# EAGLE design EnsembleEight (EAGLE 7.6.0)
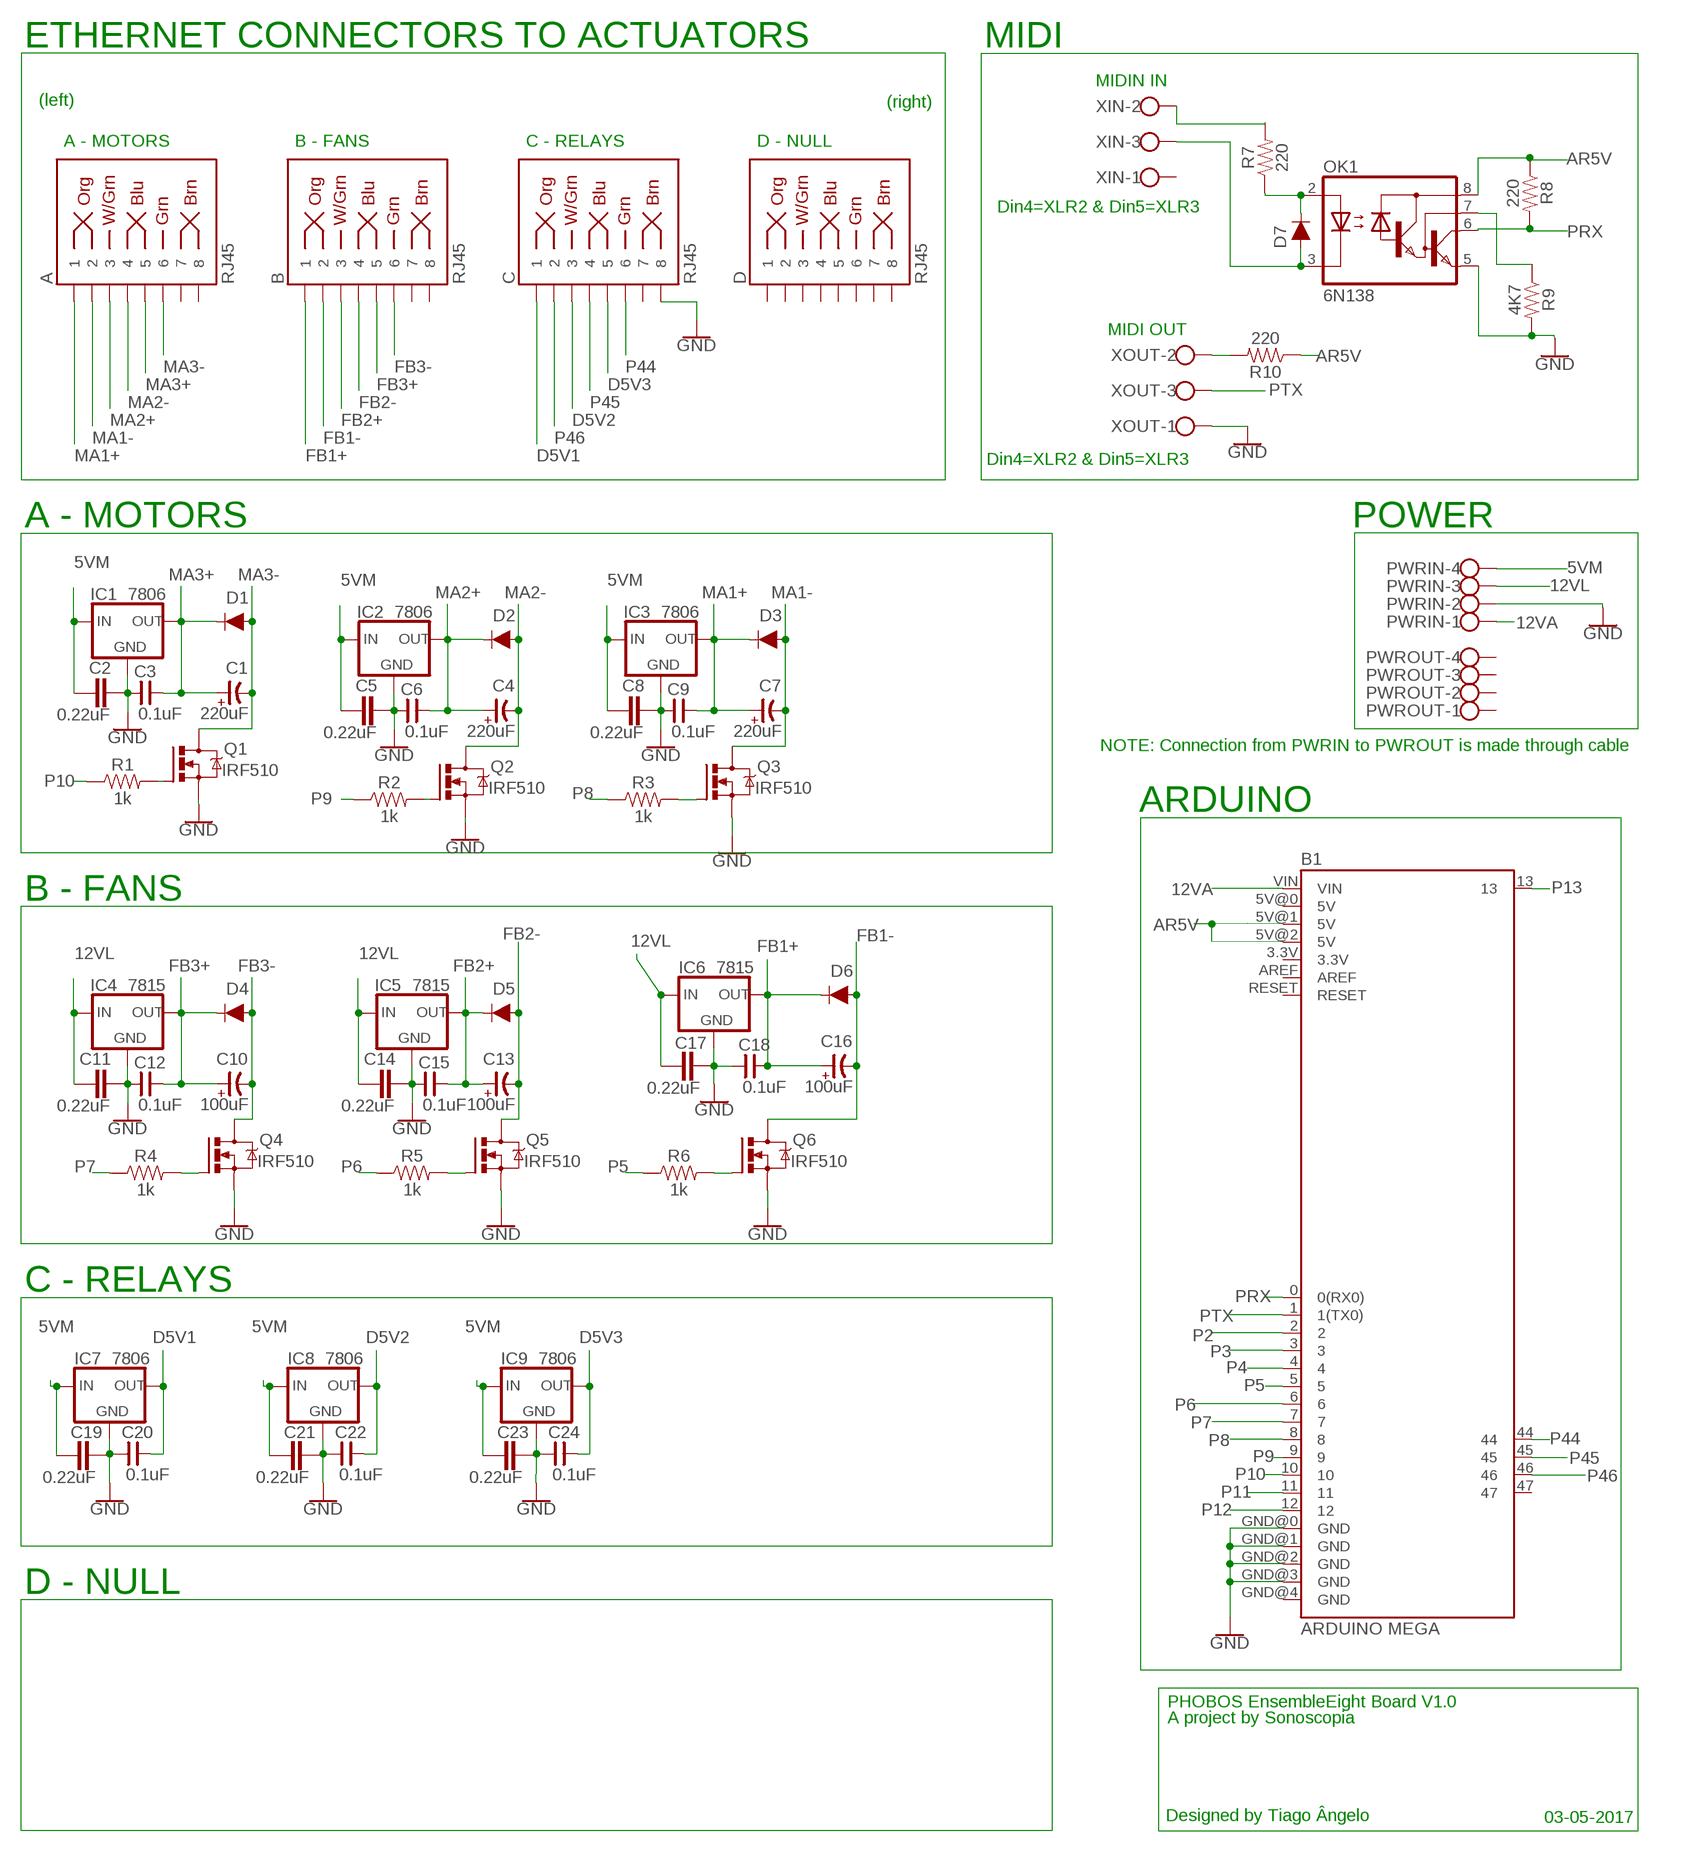
[diagram p0: schematic, sheet 1]

## Parts
A  RJ45  RJ45-8  [RJ45-8]
B  RJ45  RJ45-8  [RJ45-8]
B1  ARDUINO MEGA  ARDUINO_MEGA_R3FULL  [ARDUINO_MEGA]
C  RJ45  RJ45-8  [RJ45-8]
C1  220uF  CP-E-035X080  [E-035X080]
C2  0.22uF  C5/3  [C5B3]
C3  0.1uF  CNP-C025-050X025  [C025-050X025]
C4  220uF  CP-E-035X080  [E-035X080]
C5  0.22uF  C5/3  [C5B3]
C6  0.1uF  CNP-C025-050X025  [C025-050X025]
C7  220uF  CP-E-035X080  [E-035X080]
C8  0.22uF  C5/3  [C5B3]
C9  0.1uF  CNP-C025-050X025  [C025-050X025]
C10  100uF  CAP-MASTER_CP-E-020X050  [CAP-MASTER_E-020X050]
C11  0.22uF  C5/3  [C5B3]
C12  0.1uF  CNP-C025-050X025  [C025-050X025]
C13  100uF  CAP-MASTER_CP-E-020X050  [CAP-MASTER_E-020X050]
C14  0.22uF  C5/3  [C5B3]
C15  0.1uF  CNP-C025-050X025  [C025-050X025]
C16  100uF  CAP-MASTER_CP-E-020X050  [CAP-MASTER_E-020X050]
C17  0.22uF  C5/3  [C5B3]
C18  0.1uF  CNP-C025-050X025  [C025-050X025]
C19  0.22uF  C5/3  [C5B3]
C20  0.1uF  CNP-C025-050X025  [C025-050X025]
C21  0.22uF  C5/3  [C5B3]
C22  0.1uF  CNP-C025-050X025  [C025-050X025]
C23  0.22uF  C5/3  [C5B3]
C24  0.1uF  CNP-C025-050X025  [C025-050X025]
D  RJ45  RJ45-8  [RJ45-8]
D1  1A/50V/1.1V  DIODE-KIT2  [DIODE-1N4001-KIT]
D2  1A/50V/1.1V  DIODE-KIT2  [DIODE-1N4001-KIT]
D3  1A/50V/1.1V  DIODE-KIT2  [DIODE-1N4001-KIT]
D4  1A/50V/1.1V  DIODE-KIT2  [DIODE-1N4001-KIT]
D5  1A/50V/1.1V  DIODE-KIT2  [DIODE-1N4001-KIT]
D6  1A/50V/1.1V  DIODE-KIT2  [DIODE-1N4001-KIT]
D7  200mA/100V/1V  DIODE-1N4148  [DIODE-1N4148]
IC1  7806  78XXS  [78XXS]
IC2  7806  78XXS  [78XXS]
IC3  7806  78XXS  [78XXS]
IC4  7815  78XXS  [78XXS]
IC5  7815  78XXS  [78XXS]
IC6  7815  78XXS  [78XXS]
IC7  7806  78XXS  [78XXS]
IC8  7806  78XXS  [78XXS]
IC9  7806  78XXS  [78XXS]
OK1  6N138  [DIL08]
PWRIN  W237-4  [W237-4]
PWROUT  W237-4  [W237-4]
Q1  IRF510  IRF520  [TO220BV]
Q2  IRF510  IRF520  [TO220BV]
Q3  IRF510  IRF520  [TO220BV]
Q4  IRF510  IRF520  [TO220BV]
Q5  IRF510  IRF520  [TO220BV]
Q6  IRF510  IRF520  [TO220BV]
R1  1k  1KOHM-VERT-1/4W-1%  [AXIAL-0.1]
R2  1k  1KOHM-VERT-1/4W-1%  [AXIAL-0.1]
R3  1k  1KOHM-VERT-1/4W-1%  [AXIAL-0.1]
R4  1k  1KOHM-VERT-1/4W-1%  [AXIAL-0.1]
R5  1k  1KOHM-VERT-1/4W-1%  [AXIAL-0.1]
R6  1k  1KOHM-VERT-1/4W-1%  [AXIAL-0.1]
R7  220  1KOHM-HORIZ-1/4W-5%  [AXIAL-0.3]
R8  220  1KOHM-HORIZ-1/4W-5%  [AXIAL-0.3]
R9  4K7  1KOHM-HORIZ-1/4W-5%  [AXIAL-0.3]
R10  220  1KOHM-HORIZ-1/4W-5%  [AXIAL-0.3]
XIN  W237-103  [W237-103]
XOUT  W237-103  [W237-103]

## Nets
5VM [5VM]: C2.1 C5.1 C8.1 C19.1 C21.1 C23.1 IC1.IN IC2.IN IC3.IN IC7.IN IC8.IN IC9.IN PWRIN.4
12VA [12VA]: B1.VIN PWRIN.1
12VL [12VL]: C11.1 C14.1 C17.1 IC4.IN IC5.IN IC6.IN PWRIN.3
AR5V: B1.5V@1(5V) B1.5V@2(5V) OK1.8(VCC) R8.P$1 R10.P$1
D5V1: C20.2 C.1 IC7.OUT
D5V2: C22.2 C.3 IC8.OUT
D5V3: C24.2 C.5 IC9.OUT
FB1+: B.1 C16.+ C18.2 D6.C IC6.OUT
FB1-: B.2 C16.- D6.A Q6.D
FB2+: B.3 C13.+ C15.2 D5.C IC5.OUT
FB2-: B.4 C13.- D5.A Q5.D
FB3+: B.5 C10.+ C12.2 D4.C IC4.OUT
FB3-: B.6 C10.- D4.A Q4.D
GND [GND]: B1.GND@0(GND) B1.GND@1(GND) B1.GND@2(GND) B1.GND@3(GND) C2.2 C3.1 C5.2 C6.1 C8.2 C9.1 C11.2 C12.1 C14.2 C15.1 C17.2 C18.1 C19.2 C20.1 C21.2 C22.1 C23.2 C24.1 C.8 IC1.GND IC2.GND IC3.GND IC4.GND IC5.GND IC6.GND IC7.GND IC8.GND IC9.GND OK1.5(GND) PWRIN.2 Q1.S Q2.S Q3.S Q4.S Q5.S Q6.S R9.P$2 XOUT.1
MA1+: A.1 C7.+ C9.2 D3.C IC3.OUT
MA1-: A.2 C7.- D3.A Q3.D
MA2+: A.3 C4.+ C6.2 D2.C IC2.OUT
MA2-: A.4 C4.- D2.A Q2.D
MA3+: A.5 C1.+ C3.2 D1.C IC1.OUT
MA3-: A.6 C1.- D1.A Q1.D
N$1: Q1.G R1.P$2
N$2: R10.P$2 XOUT.2
N$4: Q3.G R3.P$2
N$5: Q4.G R4.P$2
N$9: Q5.G R5.P$2
N$14: Q6.G R6.P$2
N$20: Q2.G R2.P$2
N$25: D7.A OK1.3(C) XIN.3
N$26: D7.C OK1.2(A) R7.P$1
N$27: R7.P$2 XIN.2
N$29: OK1.7(VB) R9.P$1
P2: B1.2
P3: B1.3
P4: B1.4
P5: B1.5 R6.P$1
P6: B1.6 R5.P$1
P7: B1.7 R4.P$1
P8: B1.8 R3.P$1
P9: B1.9 R2.P$1
P10: B1.10 R1.P$1
P11: B1.11
P12: B1.12
P13: B1.13
P44: B1.44 C.6
P45: B1.45 C.4
P46: B1.46 C.2
PRX: B1.0(0(RX0)) OK1.6(VO) R8.P$2
PTX: B1.1(1(TX0)) XOUT.3
Unconnected: A.7 A.8 B1.3.3V B1.5V@0(5V) B1.47 B1.AREF B1.GND@4(GND) B1.RESET B.7 B.8 C.7 D.1 D.2 D.3 D.4 D.5 D.6 D.7 D.8 PWROUT.1 PWROUT.2 PWROUT.3 PWROUT.4 XIN.1

## Notes on the sheet
- ETHERNET CONNECTORS TO ACTUATORS | MIDI
- MIDIN IN
- (left) | (right)
- A - MOTORS | B - FANS | C - RELAYS | D - NULL
- Din4=XLR2 & Din5=XLR3
- MIDI OUT
- Din4=XLR2 & Din5=XLR3
- A - MOTORS | POWER
- NOTE: Connection from PWRIN to PWROUT is made through cable
- ARDUINO
- B - FANS
- C - RELAYS
- D - NULL
- PHOBOS EnsembleEight Board V1.0
- A project by Sonoscopia
- Designed by Tiago Ângelo | 03-05-2017

## Library data of the parts
A B C D = SparkFun-Connectors:RJ45-8: RJ45 Jack - 8 pin Simple RJ45, 8-pin connection. Commonly used for Cat5, Cat5e, and Cat6 Ethernet cables. Here is the connector we sell at SparkFun: RJ45 8-Pin Connector <https://www.sparkfun.com/products/643> (PRT-00643) Datasheet <https://cdn.sparkfun.com/datasheets/Prototyping/04908.pdf> It is used on this SparkFun product: SparkFun RJ45 Breakout <https://www.sparkfun.com/products/716> (BOB-00716) Note, you may also be interested in the "MAGJACK" version of this. It is basically a RJ45 connector, but also has some status LEDs built into the connector housing. You can check that out in this library at the device named "MAGJACK.dev" and see these products online: RJ45 Ethernet MagJack-Compatible <https://www.sparkfun.com/products/8534> (PRT-08534) SparkFun RJ45 MagJack Breakout <https://www.sparkfun.com/products/13021> (BOB-13021); PROD_ID: CONN-08506; SF_ID: PRT-00643
B1 = PHOBOS-Boards:ARDUINO_MEGA_R3: Arduino Mega R3 ATmega2560 R3 compatible footprint. SparkFun Products: Arduino Mega 2560 R3 <https://www.sparkfun.com/products/11061>
C1 C4 C7 = cap-master:CP-: POLARIZED CAP
C2 C5 C8 C11 C14 C17 C19 C21 C23 = capacitor-wima:C: CAPACITOR naming: grid - package width
C3 C6 C9 C12 C15 C18 C20 C22 C24 = cap-master:CNP-: NON-POLARIZED CAP
C10 C13 C16 = PHOBOS-lbr:CAP-MASTER_CP-: POLARIZED CAP
D1-D6 = SparkFun-DiscreteSemi:DIODE: Diode These are standard reverse protection diodes and small signal diodes. SparkFun Products: SparkFun SparkPunk Sound Kit <https://www.sparkfun.com/products/11177> SparkFun ESP8266 Thing <https://www.sparkfun.com/products/13231>; PROD_ID: DIO-09176
D7 = SparkFun-DiscreteSemi:DIODE: Diode These are standard reverse protection diodes and small signal diodes. SparkFun Products: SparkFun SparkPunk Sound Kit <https://www.sparkfun.com/products/11177> SparkFun ESP8266 Thing <https://www.sparkfun.com/products/13231>; PROD_ID: DIO-08378
IC1-IC9 = v-reg:78XXS: VOLTAGE REGULATOR
OK1 = optocoupler:6N138: MOTOROLA OPTO COUPLER; MF: VISHAY/TELEFUNKEN; MPN: 6N138; OC_FARNELL: 9860150; OC_NEWARK: 35K5294
PWRIN PWROUT = con-wago-500:W237-4: WAGO SCREW CLAMP; OC_FARNELL: unknown; OC_NEWARK: unknown
Q1-Q6 = transistor-power:IRF520: HEXFET Power MOSFET
R1-R6 = SparkFun-Resistors:1KOHM: 1kΩ resistor A resistor is a passive two-terminal electrical component that implements electrical resistance as a circuit element. Resistors act to reduce current flow, and, at the same time, act to lower voltage levels within circuits. - Wikipedia; PROD_ID: RES-12182
R7-R10 = SparkFun-Resistors:1KOHM: 1kΩ resistor A resistor is a passive two-terminal electrical component that implements electrical resistance as a circuit element. Resistors act to reduce current flow, and, at the same time, act to lower voltage levels within circuits. - Wikipedia; PROD_ID: RES-08380; VALUE: 1k
XIN XOUT = con-wago-500:W237-103: WAGO SCREW CLAMP; MPN: 237-103; OC_FARNELL: unknown; OC_NEWARK: 18M7116

## Net classes
0 default: width 0.508 mm, drill 0.508 mm, clearance 0.406 mm
1 GND: width 1.016 mm, drill 0.508 mm, clearance 0.508 mm
2 5VM: width 1.016 mm, drill 0.508 mm, clearance 0.508 mm
3 12VL: width 0.61 mm, drill 0.508 mm, clearance 0.508 mm
4 12VA: width 0.508 mm, drill 0.508 mm, clearance 0.508 mm
5 AR5V: width 0.406 mm, drill 0.508 mm, clearance 0.508 mm
6 PTX: width 0.406 mm, drill 0.508 mm, clearance 0.508 mm
7 PRX: width 0.406 mm, drill 0.508 mm, clearance 0.508 mm

## Board
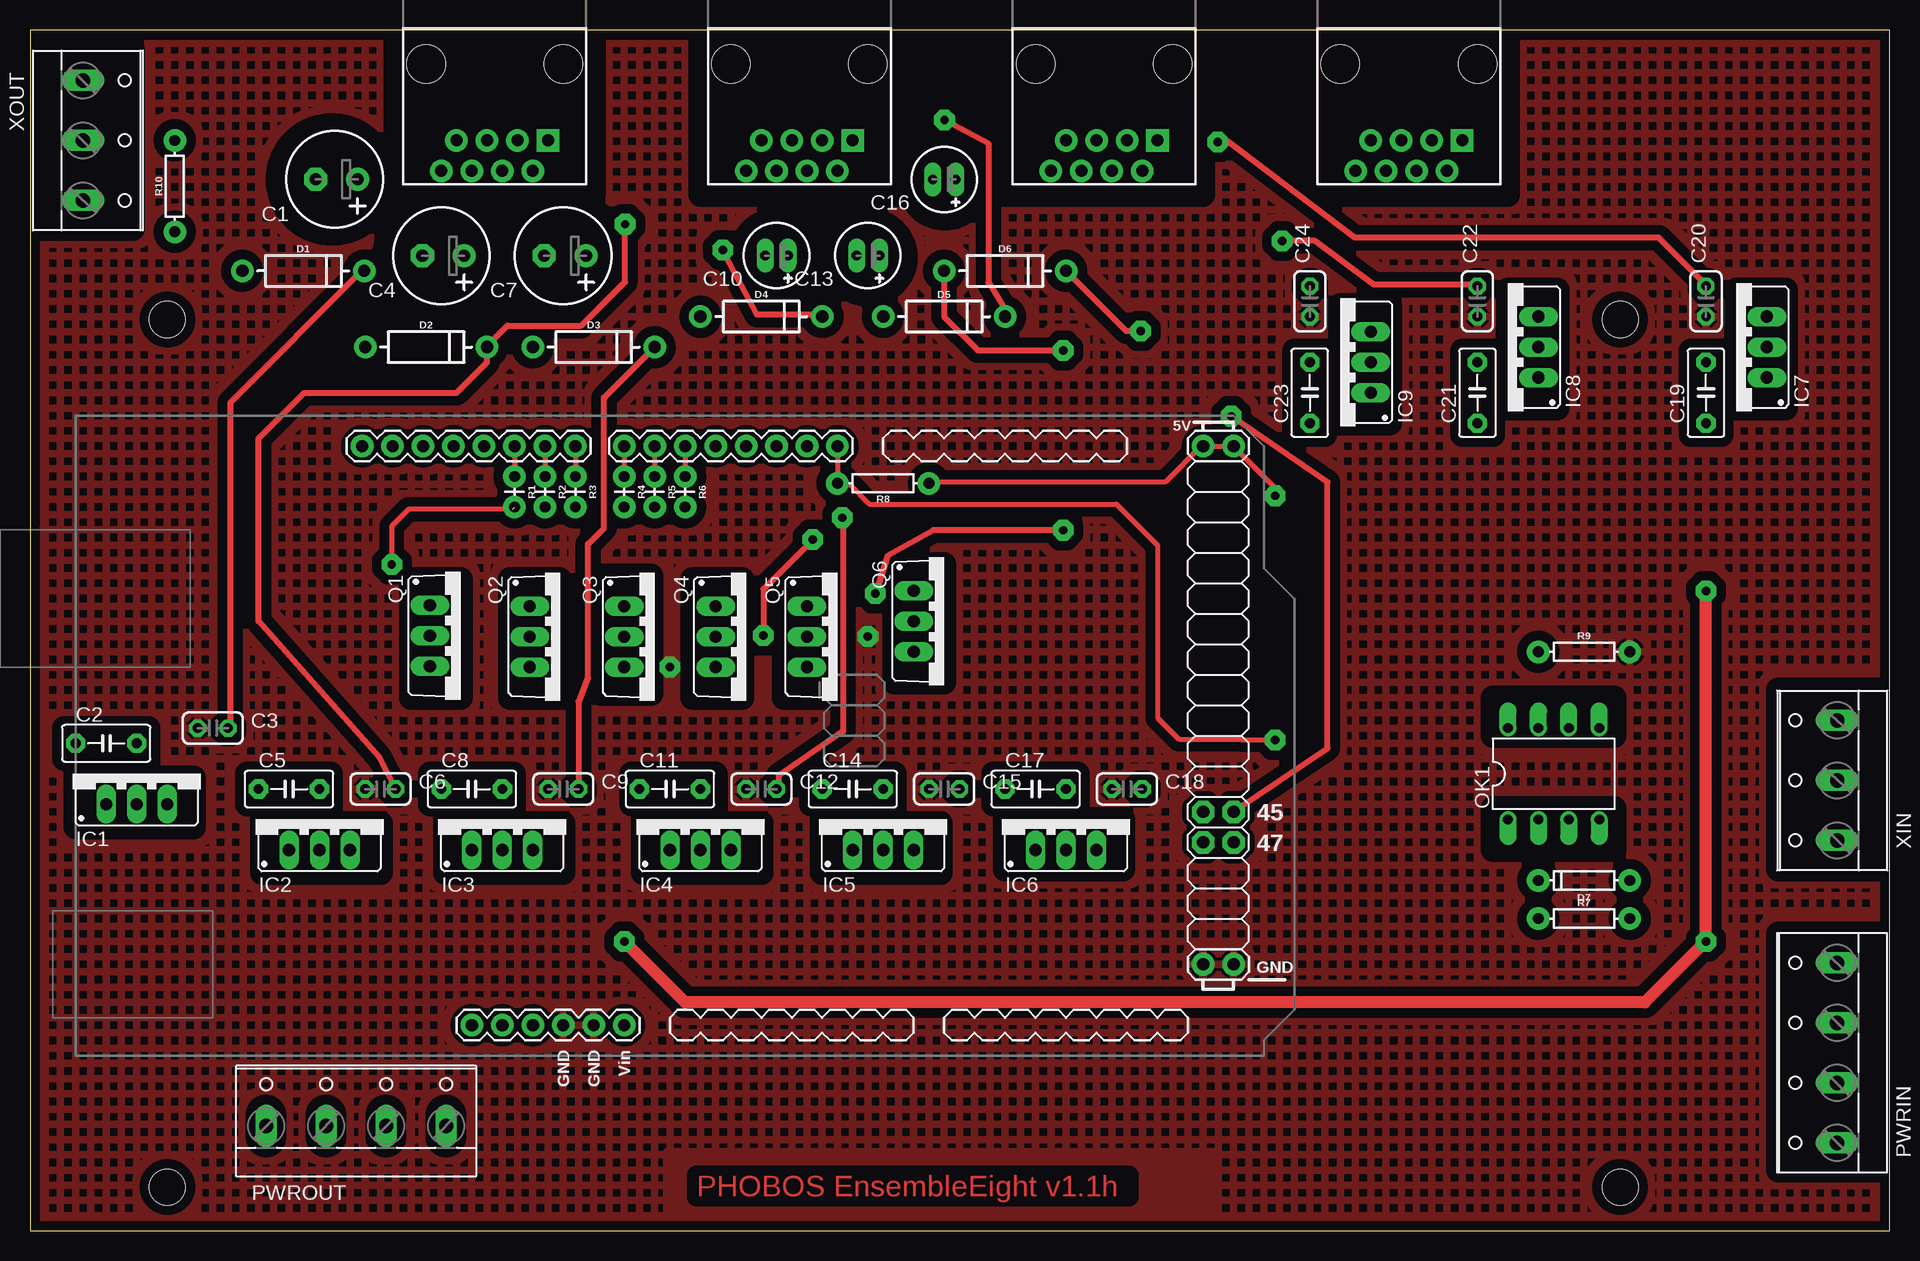
[diagram p1: board, top side]
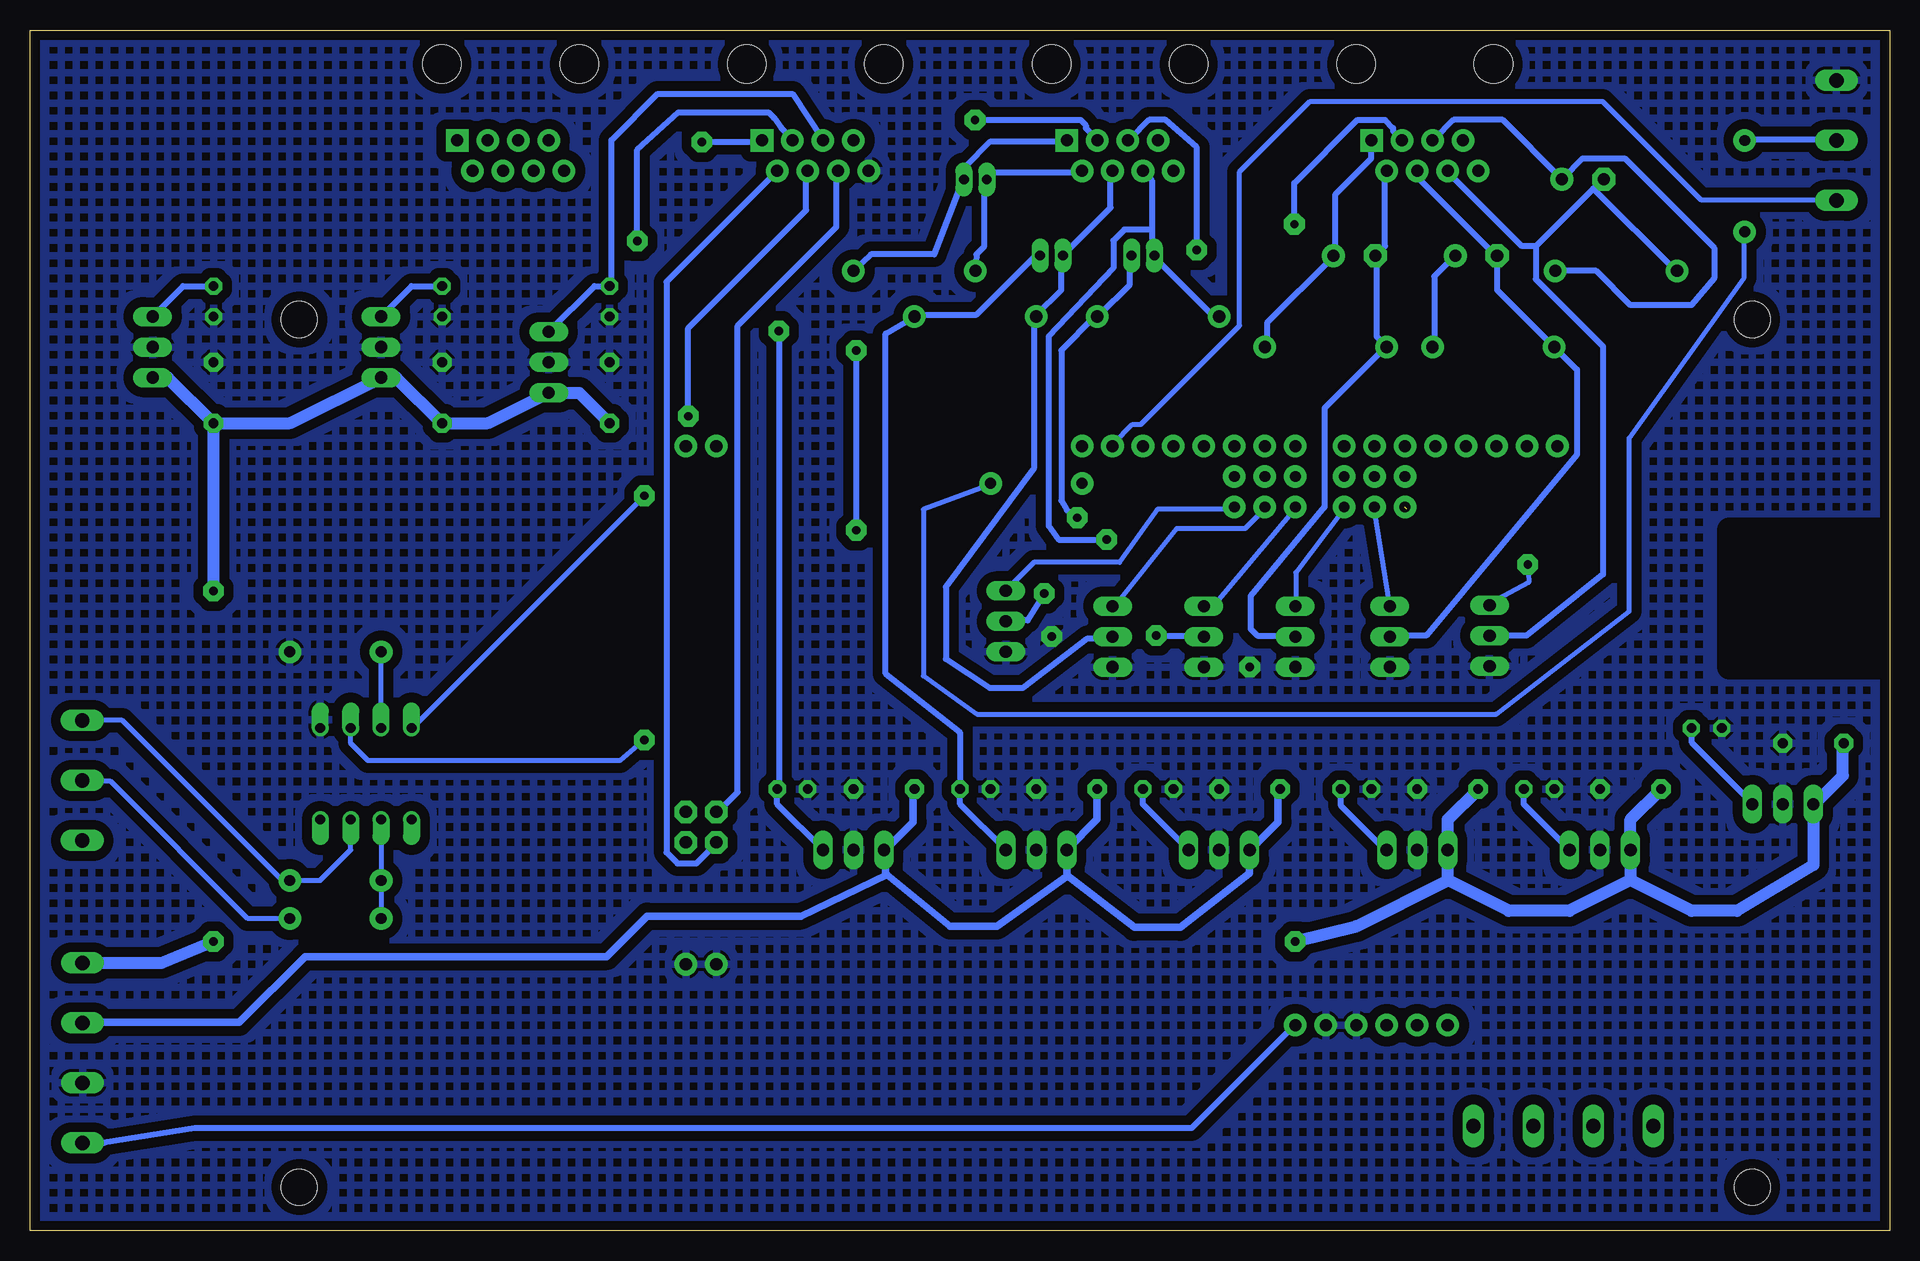
[diagram p2: board, bottom side, seen from below]

Size 155 x 100.08 mm. Coordinates in mm from the lower left corner, seen from the top.
Outline: 0,0 155,0 155,100.08 0,100.08 0,0
Copper layers (1*16): Top 0.035mm / dielectric 1.5mm / Bottom 0.035mm
Design rules "Dek": minimum track width 12mil, minimum drill 36mil, track to track 12mil, track to pad 12mil, pad to pad 12mil, via to via 12mil, smd to smd 0mil, copper to edge 10mil, drill to drill 12mil, minimum pad ring 12mil, minimum via ring 20mil, stop-mask expansion 4mil, vias tented up to drill 25mil, thermal gap 10mil
Holes 3 mm at 132.55,75.95 132.55,3.65 11.45,3.65 11.45,75.95
tRestrict: area 30.5,86.4 to 47,108; area 55.9,86.4 to 72.4,108; area 81.3,86.4 to 97.8,108; area 106.7,86.4 to 123.2,108; area 121.9,41.3 to 132.1,44.5; area 121.9,31.8 to 132.1,35.2; area 145.7,5.1 to 154.6,24.8; area 145.7,30.2 to 154.9,45.1; area -0.3,83.5 to 8.6,98.4; area 34.6,29.8 to 44.4,34; area 19.4,29.8 to 29.2,34; area 3.8,33.7 to 13.7,37.8; 27 more areas
bRestrict: area -2.5,47 to 13.3,58.4
vRestrict: area 71.1,64.1 to 91.4,66.7; area 96.5,36.2 to 101.6,64.1; area 96.5,23.5 to 101.6,31.1; area 53.3,15.9 to 73.7,18.4; area 76.2,15.9 to 96.5,18.4; area -2.5,47 to 13.3,58.4; area 121.9,35.6 to 132.1,40.6; area 43.8,72.4 to 50.2,74.9; area 78.1,79.7 to 84.5,82.5; area 57.8,74.6 to 64.1,77.5; area 73,74.6 to 79.4,77.5; area 29.8,72.1 to 36.2,74.9; 1 more areas

### Footprints (pad centres in the part's own frame; a part is rotated, then mirrored left to right if it is on the bottom)
RJ45-8 = drill 1 pad 1.88 square: 1 -4.445,6.35 | drill 1 pad 1.88: 2 -3.175,8.89; 3 -1.905,6.35; 4 -0.635,8.89; 5 0.635,6.35; 6 1.905,8.89; 7 3.175,6.35; 8 4.445,8.89 | hole 3.2: -5.715,0; 5.715,0
ARDUINO_MEGA = drill 1.016 pad 1.88: 0 13.97,24.13; 1 11.43,24.13; 2 8.89,24.13; 3 6.35,24.13; 3.3V -13.97,-24.13; 4 3.81,24.13; 5 1.27,24.13; 5V@0 -11.43,-24.13; 5V@1 44.45,24.13; 5V@2 46.99,24.13; 6 -1.27,24.13; 7 -3.81,24.13; 8 -7.874,24.13; 9 -10.414,24.13; 10 -12.954,24.13; 11 -15.494,24.13; 12 -18.034,24.13; 13 -20.574,24.13; AREF -25.654,24.13; GND@0 -8.89,-24.13; GND@1 -6.35,-24.13; GND@2 44.45,-19.05; GND@3 46.99,-19.05; GND@4 -23.114,24.13; RESET -16.51,-24.13; VIN -3.81,-24.13 | drill 1.016 pad 1.88 octagon: 44 44.45,-6.35; 45 46.99,-6.35; 46 44.45,-8.89; 47 46.99,-8.89
E-035X080 = drill 1.016 pad 1.93: + -1.905,0 | drill 1.016 pad 1.93 octagon: - 1.587,0
C5B3 = drill 0.813 pad 1.6 octagon: 1 -2.54,0; 2 2.54,0
C025-050X025 = drill 0.813 pad 1.422 octagon: 1 -1.27,0; 2 1.27,0
CAP-MASTER_E-020X050 = drill 0.813 long: + -0.953,0; - 0.953,0
DIODE-1N4001-KIT = drill 1.016 pad 1.88: A -5.08,0; C 5.08,0
DIODE-1N4148 = drill 0.9 pad 1.88: A -3.81,0; C 3.81,0
78XXS = drill 1.016 long: GND 0,-2.54; IN -2.54,-2.54; OUT 2.54,-2.54
DIL08 = drill 0.813 offset: 1 -3.81,-3.81; 2 -1.27,-3.81; 3 1.27,-3.81; 4 3.81,-3.81; 5 3.81,3.81; 6 1.27,3.81; 7 -1.27,3.81; 8 -3.81,3.81
W237-4 = drill 1.194 long: 1 -7.5,-1.27; 2 -2.5,-1.27; 3 2.5,-1.27; 4 7.5,-1.27
TO220BV = drill 1.016 long: D 0,-2.54; G -2.54,-2.54; S 2.54,-2.54
AXIAL-0.1 = drill 0.9 pad 1.88: P$1 -1.27,0; P$2 1.27,0
AXIAL-0.3 = drill 0.9 pad 1.88: P$1 -3.81,0; P$2 3.81,0
W237-103 = drill 1.194 long: 1 -5,-1.29; 2 0,-1.29; 3 5,-1.29

### Placement (x,y rotation side)
A  38.73,97.23 180 top
B  64.13,97.23 180 top
B1  53.34,41.27 0 top
C  89.53,97.23 180 top
C1  25.4,87.63 180 top
C2  6.35,40.64 0 top
C3  15.24,41.91 0 top
C4  34.29,81.28 180 top
C5  21.59,36.83 0 top
C6  29.21,36.83 0 top
C7  44.45,81.28 180 top
C8  36.83,36.83 0 top
C9  44.45,36.83 0 top
C10  62.23,81.28 180 top
C11  53.34,36.83 0 top
C12  60.96,36.83 0 top
C13  69.85,81.28 180 top
C14  68.58,36.83 0 top
C15  76.2,36.83 0 top
C16  76.2,87.63 180 top
C17  83.82,36.83 0 top
C18  91.44,36.83 0 top
C19  139.7,69.85 90 top
C20  139.7,77.47 90 top
C21  120.65,69.85 90 top
C22  120.65,77.47 90 top
C23  106.68,69.85 90 top
C24  106.68,77.47 90 top
D  114.94,97.23 180 top
D1  22.78,80.01 0 top
D2  33.02,73.66 0 top
D3  46.99,73.66 0 top
D4  60.96,76.2 0 top
D5  76.2,76.2 0 top
D6  81.28,80.01 0 top
D7  129.54,29.21 180 top
IC1  8.89,38.1 0 top
IC2  24.13,34.29 0 top
IC3  39.37,34.29 0 top
IC4  55.88,34.29 0 top
IC5  71.12,34.29 0 top
IC6  86.36,34.29 0 top
IC7  142.24,73.66 90 top
IC8  123.19,73.66 90 top
IC9  109.22,72.39 90 top
OK1  127,38.1 0 top
PWRIN  149.35,14.84 90 top
PWROUT  27.18,10.01 0 top
Q1  35.88,49.6 270 top
Q2  44.2,49.53 270 top
Q3  52.07,49.53 270 top
Q4  59.69,49.53 270 top
Q5  67.31,49.53 270 top
Q6  76.2,50.8 270 top
R1  40.39,61.59 270 top
R2  42.93,61.59 270 top
R3  45.47,61.59 270 top
R4  49.53,61.59 270 top
R5  52.07,61.59 270 top
R6  54.61,61.59 270 top
R7  129.54,26.04 0 top
R8  71.12,62.3 180 top
R9  129.54,48.26 0 top
R10  12.06,87.07 90 top
XIN  149.35,37.54 90 top
XOUT  5.71,90.88 270 top

### Tracks (layer width: path | path; a pad name or v marks a point on that pad's centre or on a via)
5VM  (via drill 0.7)
  Top 1.016: v139.7,53.34 v139.7,24.13 134.62,19.05 54.61,19.05 v49.53,24.13
  Bottom 1.016: PWRIN.4 144.03,22.34 v139.7,24.13 | v139.7,53.34 C19.1 | IC7.IN 143.51,71.12 C19.1 | C19.1 133.35,67.31 IC8.IN 124.46,71.12 C21.1 116.84,67.31 IC9.IN 109.22,69.85 C23.1 | C2.1 3.89,40.46 3.89,37.95 6.17,35.66 IC1.IN 6.35,30.48 12.7,26.67 16.51,26.67 21.59,29.21 | C5.1 21.59,34.29 IC2.IN 21.59,29.21 | C8.1 36.83,34.29 IC3.IN 36.83,29.21 | 21.59,29.21 26.67,26.67 31.75,26.67 36.83,29.21 | v49.53,24.13 44.45,25.4 36.83,29.21
12VA
  Bottom 0.508: 150.42,7.54 PWRIN.1 148.85,7.34 141.27,8.57 58.18,8.57 49.61,17.14 B1.VIN
12VL
  Bottom 0.61: C14.1 66.06,36.8 66.06,34.29 68.58,31.77 IC5.IN 68.58,29.66 | 51.21,36.8 C11.1 50.98,36.8 50.98,34.06 53.26,31.77 IC4.IN 53.34,29.81 59.12,25.3 62.95,25.3 68.58,29.66 | C17.1 81.38,36.8 81.38,34.06 83.67,31.77 IC6.IN | 83.9,31.09 83.9,31.55 IC6.IN | PWRIN.3 150.42,17.37 137.57,17.37 132.08,22.86 106.93,22.86 103.56,26.23 90.74,26.23 83.56,29.67 | 68.58,29.66 68.58,29.55 74.42,25.4 78.31,25.4 83.56,29.67 | 83.56,29.67 83.67,29.73 83.67,31.6 IC6.IN
AR5V  (via drill 0.7)
  Top 0.406: v103.78,61.27 103.78,61.95 B1.5V@2 B1.5V@1 97.61,65.38 94.64,62.41 74.98,62.41 R8.P$1
  Bottom 0.406: v103.78,61.27 122.99,42.06 OK1.8 | R10.P$1 12.12,83.21 12.12,79.45 21.69,66.06 21.69,51.64 32.79,43.08 76.07,43.08 80.53,46.27 80.53,60.12 74.98,62.18 R8.P$1
D5V1  (via drill 0.7)
  Top 0.508: v98.98,90.75 99.91,90.75 110.43,82.78 135.76,82.78 139.68,78.87 C20.2
  Bottom 0.508: IC7.OUT 142.24,78.74 C20.2 | v98.98,90.75 94.18,90.75 C.1
D5V2  (via drill 0.7)
  Top 0.508: v104.38,82.5 107.11,82.5 112.01,78.87 120.47,78.87 C22.2
  Bottom 0.508: IC8.OUT 123.19,78.74 C22.2 | v104.38,82.5 104.38,90.09 100.94,93.22 93.45,93.22 92.99,92.76 92.35,91.9 91.44,90.98 C.3
D5V3
  Bottom 0.508: IC9.OUT 107.95,78.74 C24.2 106.53,78.87 106.53,90.91 102.67,94.77 91.44,94.77 88.93,90.98 C.5
FB1+  (via drill 0.7)
  Top 0.508: v92.58,74.98 91.39,74.98 D6.C
  Bottom 0.508: IC6.OUT 92.71,35.56 C18.2 92.58,37.03 v92.58,74.98 | B.1 68.58,90.75 74.98,90.75 77.04,88.7 77.04,87.78 C16.+ 77.27,87.55 79.63,81.38 84.91,81.38 D6.C
FB1-  (via drill 0.7)
  Top 0.508: v70.47,53.1 71.5,56.26 75.31,58.4 v86.13,58.4 | D6.A 76.2,76.2 79.02,73.38 v86.13,73.38
  Bottom 0.508: D6.A 76.12,81.38 75.44,82.07 75.44,87.55 C16.- 75.21,87.78 74.75,88.24 67.44,88.24 B.2 | v70.47,53.1 71.84,50.88 73.61,50.88 Q6.D | v86.13,73.38 v86.13,58.4
FB2+  (via drill 0.7)
  Top 0.508: v76.22,92.58 79.9,90.63 79.9,79.04 81.28,76.8 D5.C
  Bottom 0.508: IC5.OUT 77.47,35.56 C15.2 77.5,37.03 77.5,41.54 83.67,46.44 83.67,74.78 D5.C | C13.+ 70.87,81.15 71.3,81.15 76.1,76.35 81.15,76.35 D5.C | v76.22,92.58 67.44,92.58 66.98,92.13 66.98,91.9 66.06,90.98 B.3 | 81.38,76.35 D5.C
FB2-
  Bottom 0.508: Q5.D 64.79,49.38 66.85,49.38 72.24,45.26 74.98,45.26 78.66,47.68 78.66,53.67 71.32,63.55 71.32,76.12 D5.A 71.09,76.35 69.04,78.41 69.04,81.15 C13.- 68.81,81.38 64.92,85.27 64.92,88.24 B.4
FB3+  (via drill 0.7)
  Top 0.508: D4.C 65.84,76.35 60.59,76.35 v57.75,81.74 | v67.72,59.44 67.78,57.66 67.78,41.64 62.41,37.95 62.41,37.03 C12.2
  Bottom 0.508: IC4.OUT 62.23,35.56 C12.2 | C10.+ 63.32,81.15 63.32,78.87 65.84,76.35 D4.C 66.29,76.12 69.04,73.38 69.04,60.87 68.58,60.06 v67.72,59.44 | v57.75,81.74 57.75,90.3 60.35,92.58 61.72,92.58 63.32,90.98 B.5
FB3-  (via drill 0.7)
  Top 0.508: v61.14,49.61 61.14,53.49 v65.25,57.61
  Bottom 0.508: 61.49,83.44 61.49,87.55 62.18,88.24 B.6 | 61.49,83.44 61.49,81.38 C10.- 61.26,81.15 56.46,76.35 56.01,76.35 D4.A | v61.14,49.61 57.25,49.61 Q4.D | v65.25,57.61 69.27,57.61 70.09,58.75 70.09,74.52 64.69,80.24 64.69,82.53 63.78,83.44 61.49,83.44
GND  (via drill 0.7)
  other vias: 53.34,46.99 69.85,49.53
  pour Bottom (isolate 0.813, hatched): -5.08,104.14 160.02,104.14 160.02,0 -5.08,0
  pour Top (isolate 0.813, hatched): 0,100.33 154.94,100.33 154.94,0 0,0
MA1+
  Top 0.508: C9.2 45.72,44.12 46.51,46.18 46.51,57.24 47.84,58.57 47.84,69.44 52.06,73.66 D3.C 51.89,73.61
  Bottom 0.508: C9.2 45.72,35.43 42.06,31.77 IC3.OUT | D3.C 51.89,73.84 51.89,75.67 46.41,81.15 C7.+ 46.18,81.38 46.18,86.41 43.2,89.38 43.2,90.75 A.1
MA1-
  Bottom 0.508: A.2 42.06,88.24 42.06,82.07 42.75,81.38 C7.- 42.75,81.15 42.75,74.52 42.06,73.84 D3.A 42.06,73.61 47.09,68.58 47.09,60.35 53.26,52.91 53.26,50.16 52.71,49.61 49.71,49.61 Q3.D
MA2+  (via drill 0.7)
  Top 0.508: v49.61,83.9 49.61,79.1 45.95,75.44 39.78,75.44 38.18,73.84 D2.C | C6.2 30.4,37.03 29.13,39.45 19.05,50.8 19.05,66.04 22.86,69.85 35.56,69.85 38.1,72.39 D2.C | 37.95,73.61 D2.C
  Bottom 0.508: IC2.OUT 30.48,35.56 C6.2 | D2.C 37.95,73.84 37.95,79.55 36.35,81.15 C4.+ | v49.61,83.9 49.61,87.33 44.35,92.58 42.06,92.58 41.38,91.9 41.38,91.67 40.69,90.98 A.3
MA2-
  Bottom 0.508: A.4 39.32,88.24 39.32,87.78 32.92,81.38 C4.- 32.69,81.15 32.69,78.41 D2.A 26.06,71.78 26.06,64.69 38.61,49.61 41.48,49.61 Q2.D
MA3+
  Top 0.508: C3.2 16.69,42.06 16.69,69.04 27.66,80.01 D1.C
  Bottom 0.508: C3.2 16.46,41.83 16.46,40.69 11.43,35.66 IC1.OUT | A.5 37.95,90.98 36.35,92.58 32.23,92.58 27.43,87.78 C1.+ 27.2,87.78 25.6,89.38 22.07,89.38 14.6,81.92 14.6,79.38 16.51,77.15 21.59,77.15 24.45,80.01 D1.C
MA3-
  Bottom 0.508: 29.49,82.07 29.49,79.32 23.88,73.71 23.88,54.71 30.25,49.61 33.25,49.61 Q1.D | 24.69,86.87 24,87.55 C1.- | 24.69,86.87 29.49,82.07 | 24.69,86.87 17.83,80.01 D1.A | 29.49,82.07 30.63,82.07 36.8,88.24 A.6
N$1  (via drill 0.7)  (1 unrouted)
  Top 0.406: 40.23,60.12 31.55,60.12 30.16,58.74 30.16,55.56 v30.15,55.55
  Bottom 0.406: 33.25,52.35 30.07,54.04 v30.15,55.55
  Bottom 0.508: 33.25,52.35 Q1.G
N$2
  Bottom 0.508: XOUT.2 4.57,90.98 11.89,90.98 R10.P$2
N$3
  pour Top (isolate 0.813): 53.02,6.67 98.74,6.67 98.74,0.32 53.02,0.32
N$4
  Bottom 0.406: 49.48,52.12 49.48,54.86 45.49,60.12 R3.P$2
  Bottom 0.508: 49.48,52.12 Q3.G
N$5
  Bottom 0.406: 57.02,52.12 56.34,52.12 49.61,60.12 R4.P$2
  Bottom 0.508: 57.02,52.12 Q4.G
N$9
  Bottom 0.406: 52.12,60.12 53.72,58.52 59.44,58.52 64.57,52.12 Q5.G
  Bottom 0.508: 52.12,60.12 R5.P$2
N$14
  Bottom 0.406: R6.P$2 54.63,60.12 61.04,60.12 64.17,55.72 71.32,55.72 73.66,53.38 Q6.G
N$20
  Bottom 0.406: 41.71,52.12 42.98,60.12 R2.P$2
  Bottom 0.508: 41.71,52.12 Q2.G
N$25
  Bottom 0.406: OK1.3 128.27,31.75 130.81,29.21 D7.A 133.99,29.21 147.32,42.55 XIN.3
N$26
  Bottom 0.406: OK1.2 D7.C R7.P$1
N$27
  Bottom 0.406: R7.P$2 136.84,26.04 148.27,37.47 150.56,37.47 XIN.2
N$29
  Bottom 0.406: OK1.7 R9.P$1
P5
  Top 0.406: B1.5 R6.P$1
P6
  Top 0.406: B1.6 R5.P$1
P7
  Top 0.406: B1.7 R4.P$1
P8
  Top 0.406: B1.8 R3.P$1
P9
  Top 0.406: B1.9 R2.P$1
P10
  Top 0.406: B1.10 R1.P$1
P44
  Bottom 0.508: C.6 87.78,88.24 87.78,83.67 96.01,75.44 96.01,36.58 97.61,34.98 B1.44
P45  (via drill 0.7)
  Top 0.508: v100.13,67.89 108.15,62.41 108.15,40.23 100.35,34.98 B1.45
  Bottom 0.508: v100.13,67.89 100.13,75.23 90.3,85.06 90.3,88.24 C.4
P46
  Bottom 0.508: B1.46 97.84,32.23 99.44,30.63 101.04,30.63 101.96,31.55 101.96,79.1 92.81,88.24 C.2
PRX  (via drill 0.7)
  Top 0.406: B1.0 R8.P$2 67.44,62.18 68.35,62.18 69.95,60.58 90.55,60.58 93.98,57.15 93.98,42.77 95.78,40.98 100.98,40.98 101.04,40.92 v103.78,40.92
  Bottom 0.406: 127.79,41.83 128.25,41.83 OK1.6 128.27,40.64 126.82,39.19 105.83,39.19 v103.78,40.92
PTX
  Bottom 0.406: XOUT.3 4.57,85.95 15.75,85.95 23.93,94.13 48.3,94.13 54.18,88.25 54.18,75.44 62.41,67.21 63.09,67.21 64.69,65.61 B1.1

### Text on the board
Top: PHOBOS EnsembleEight v1.1h
tSilk: VINYL | SERVOS | STRINGS | LIGHTS